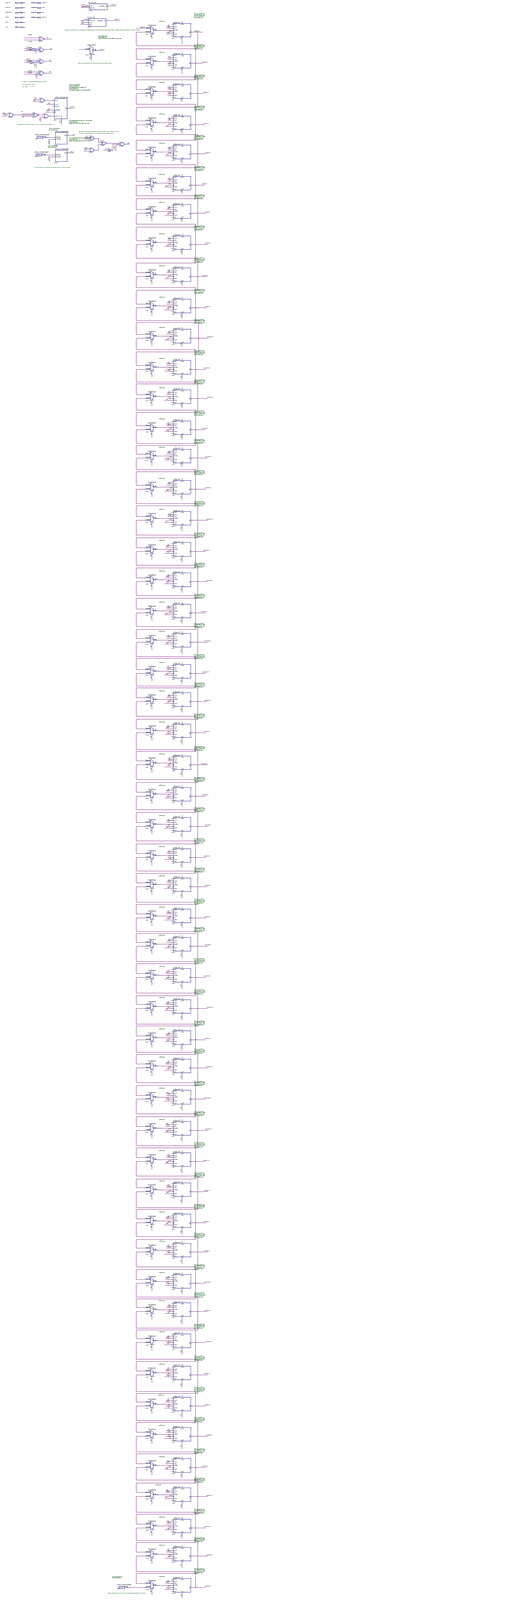
[diagram p0: schematic sheet, whole]
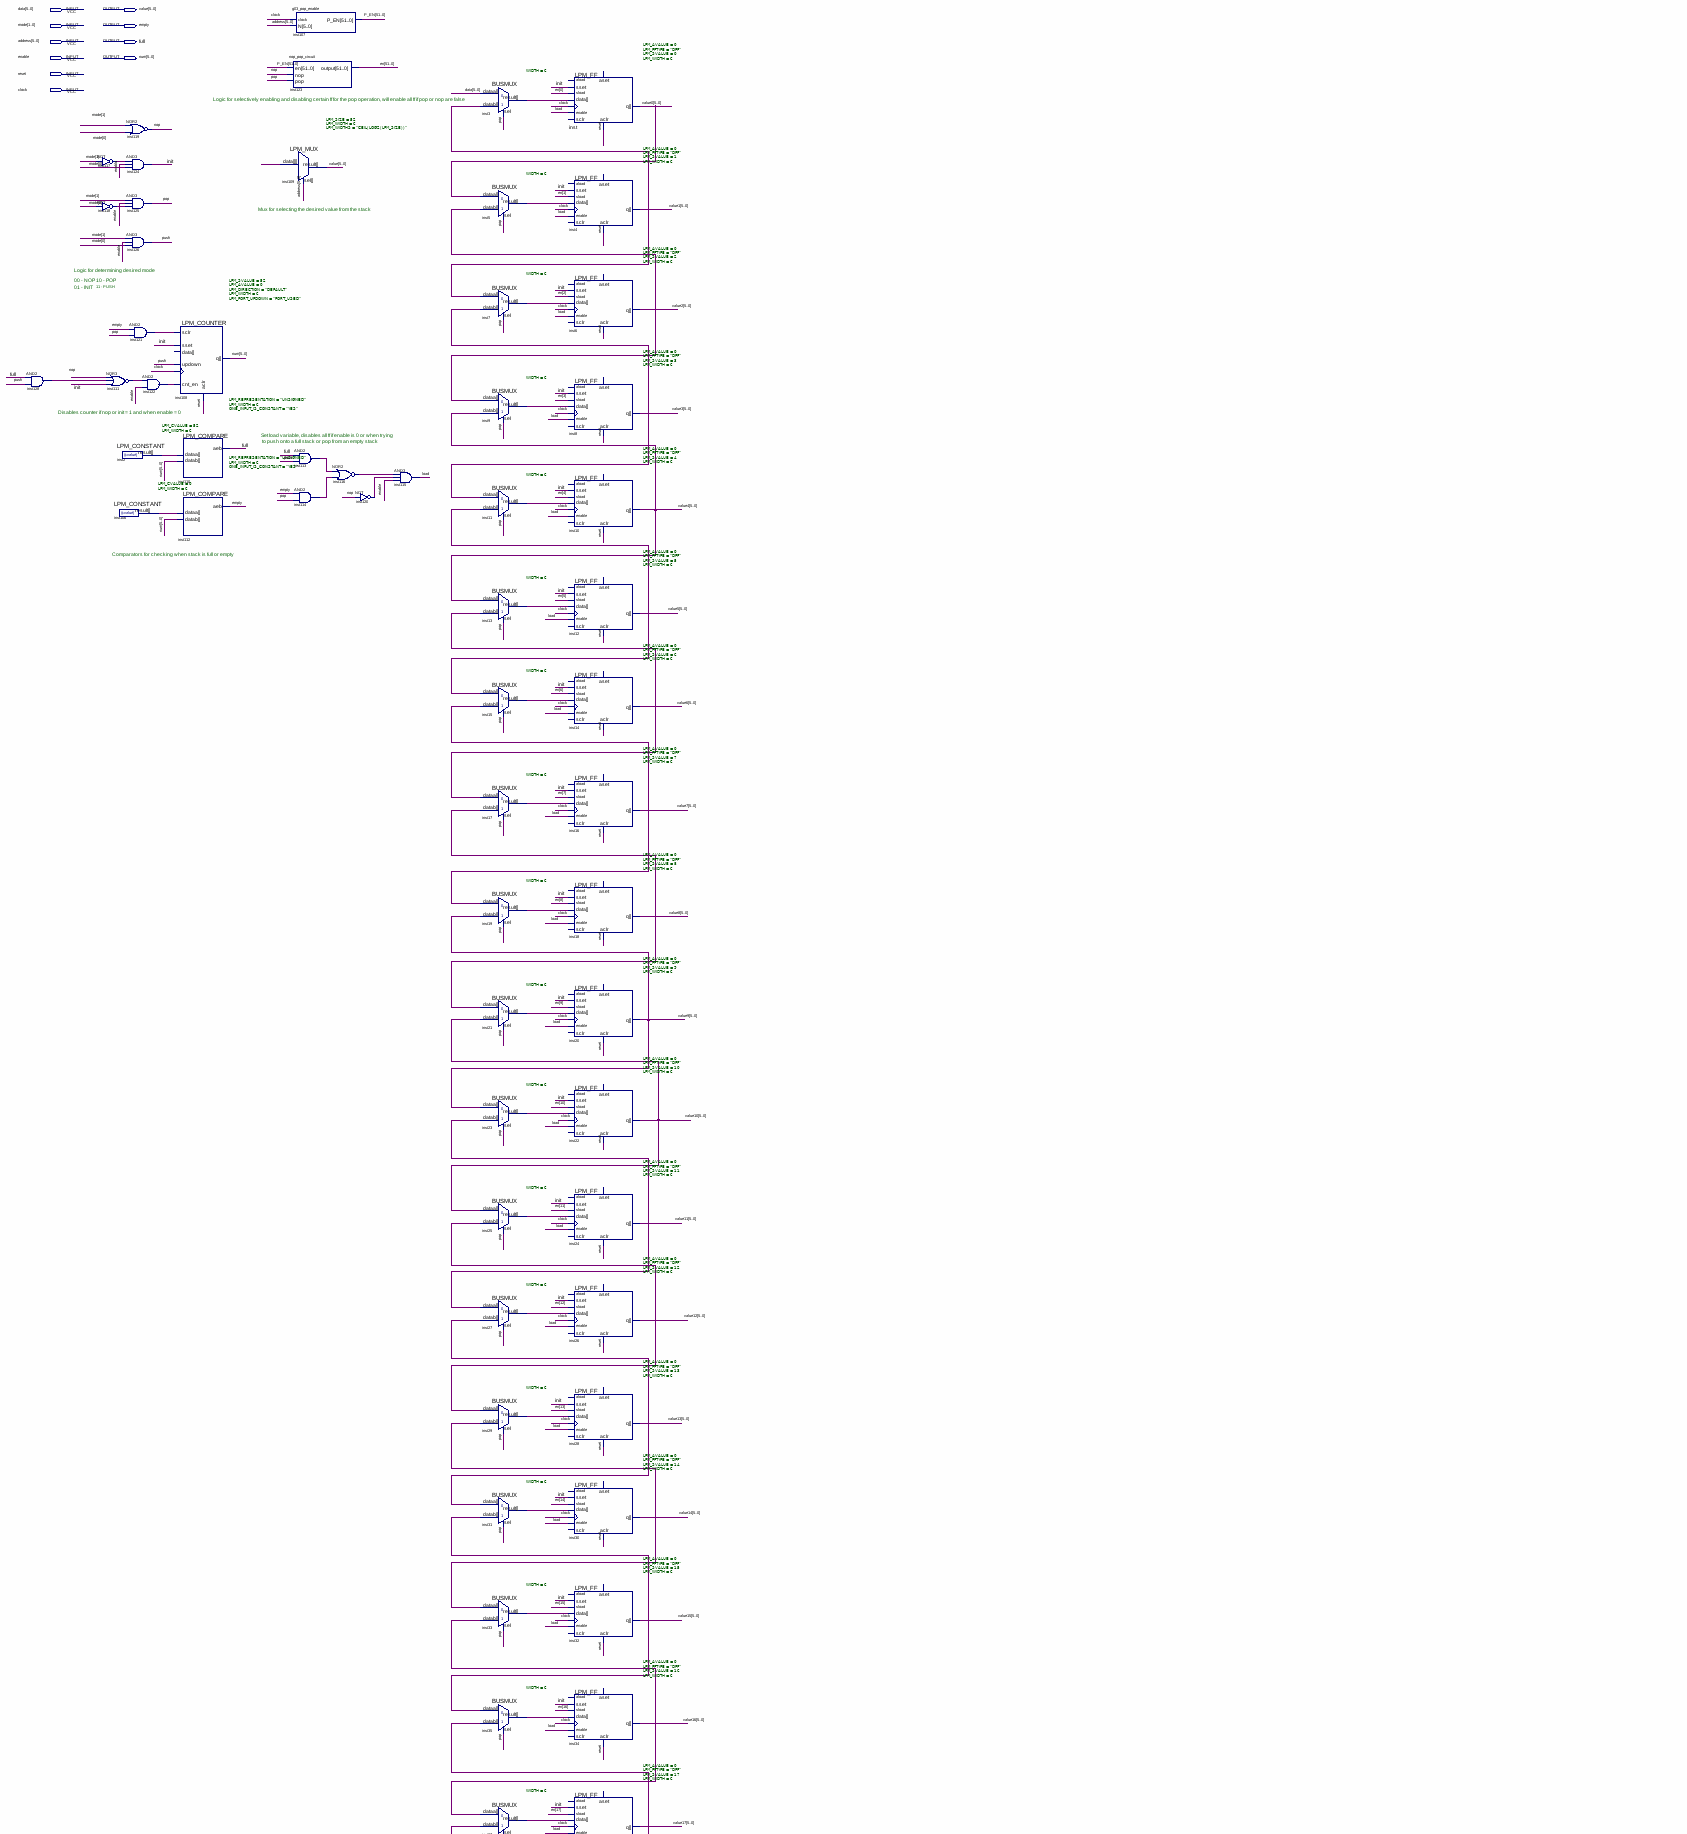
[diagram p1: schematic sheet, upper part]
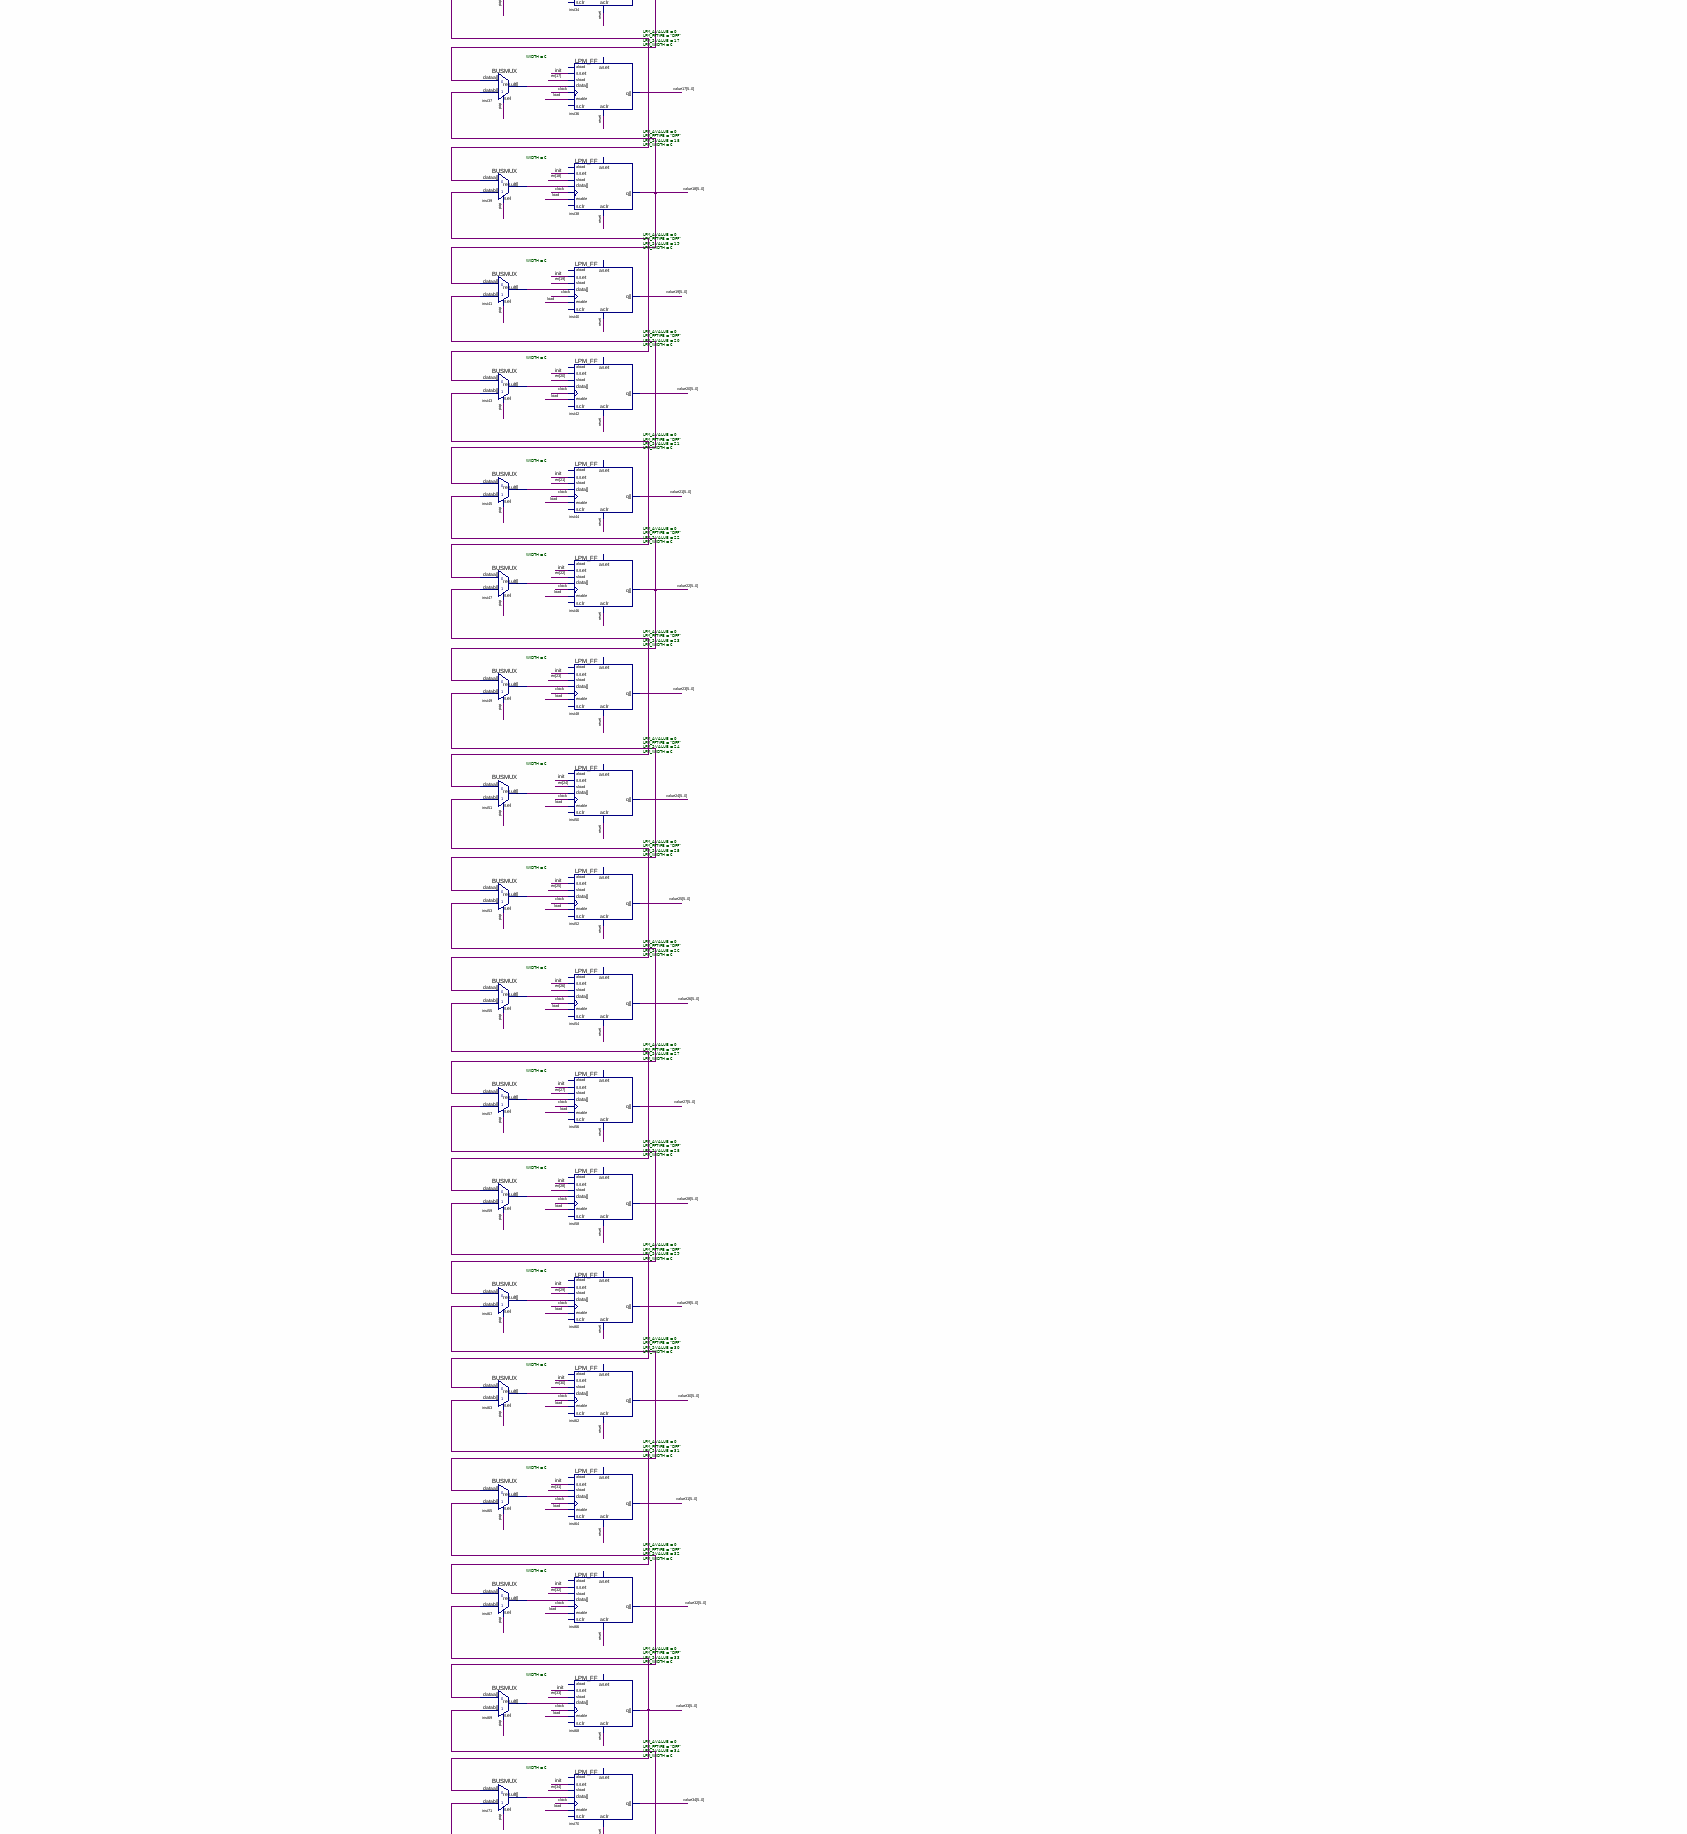
[diagram p2: schematic sheet, middle part]
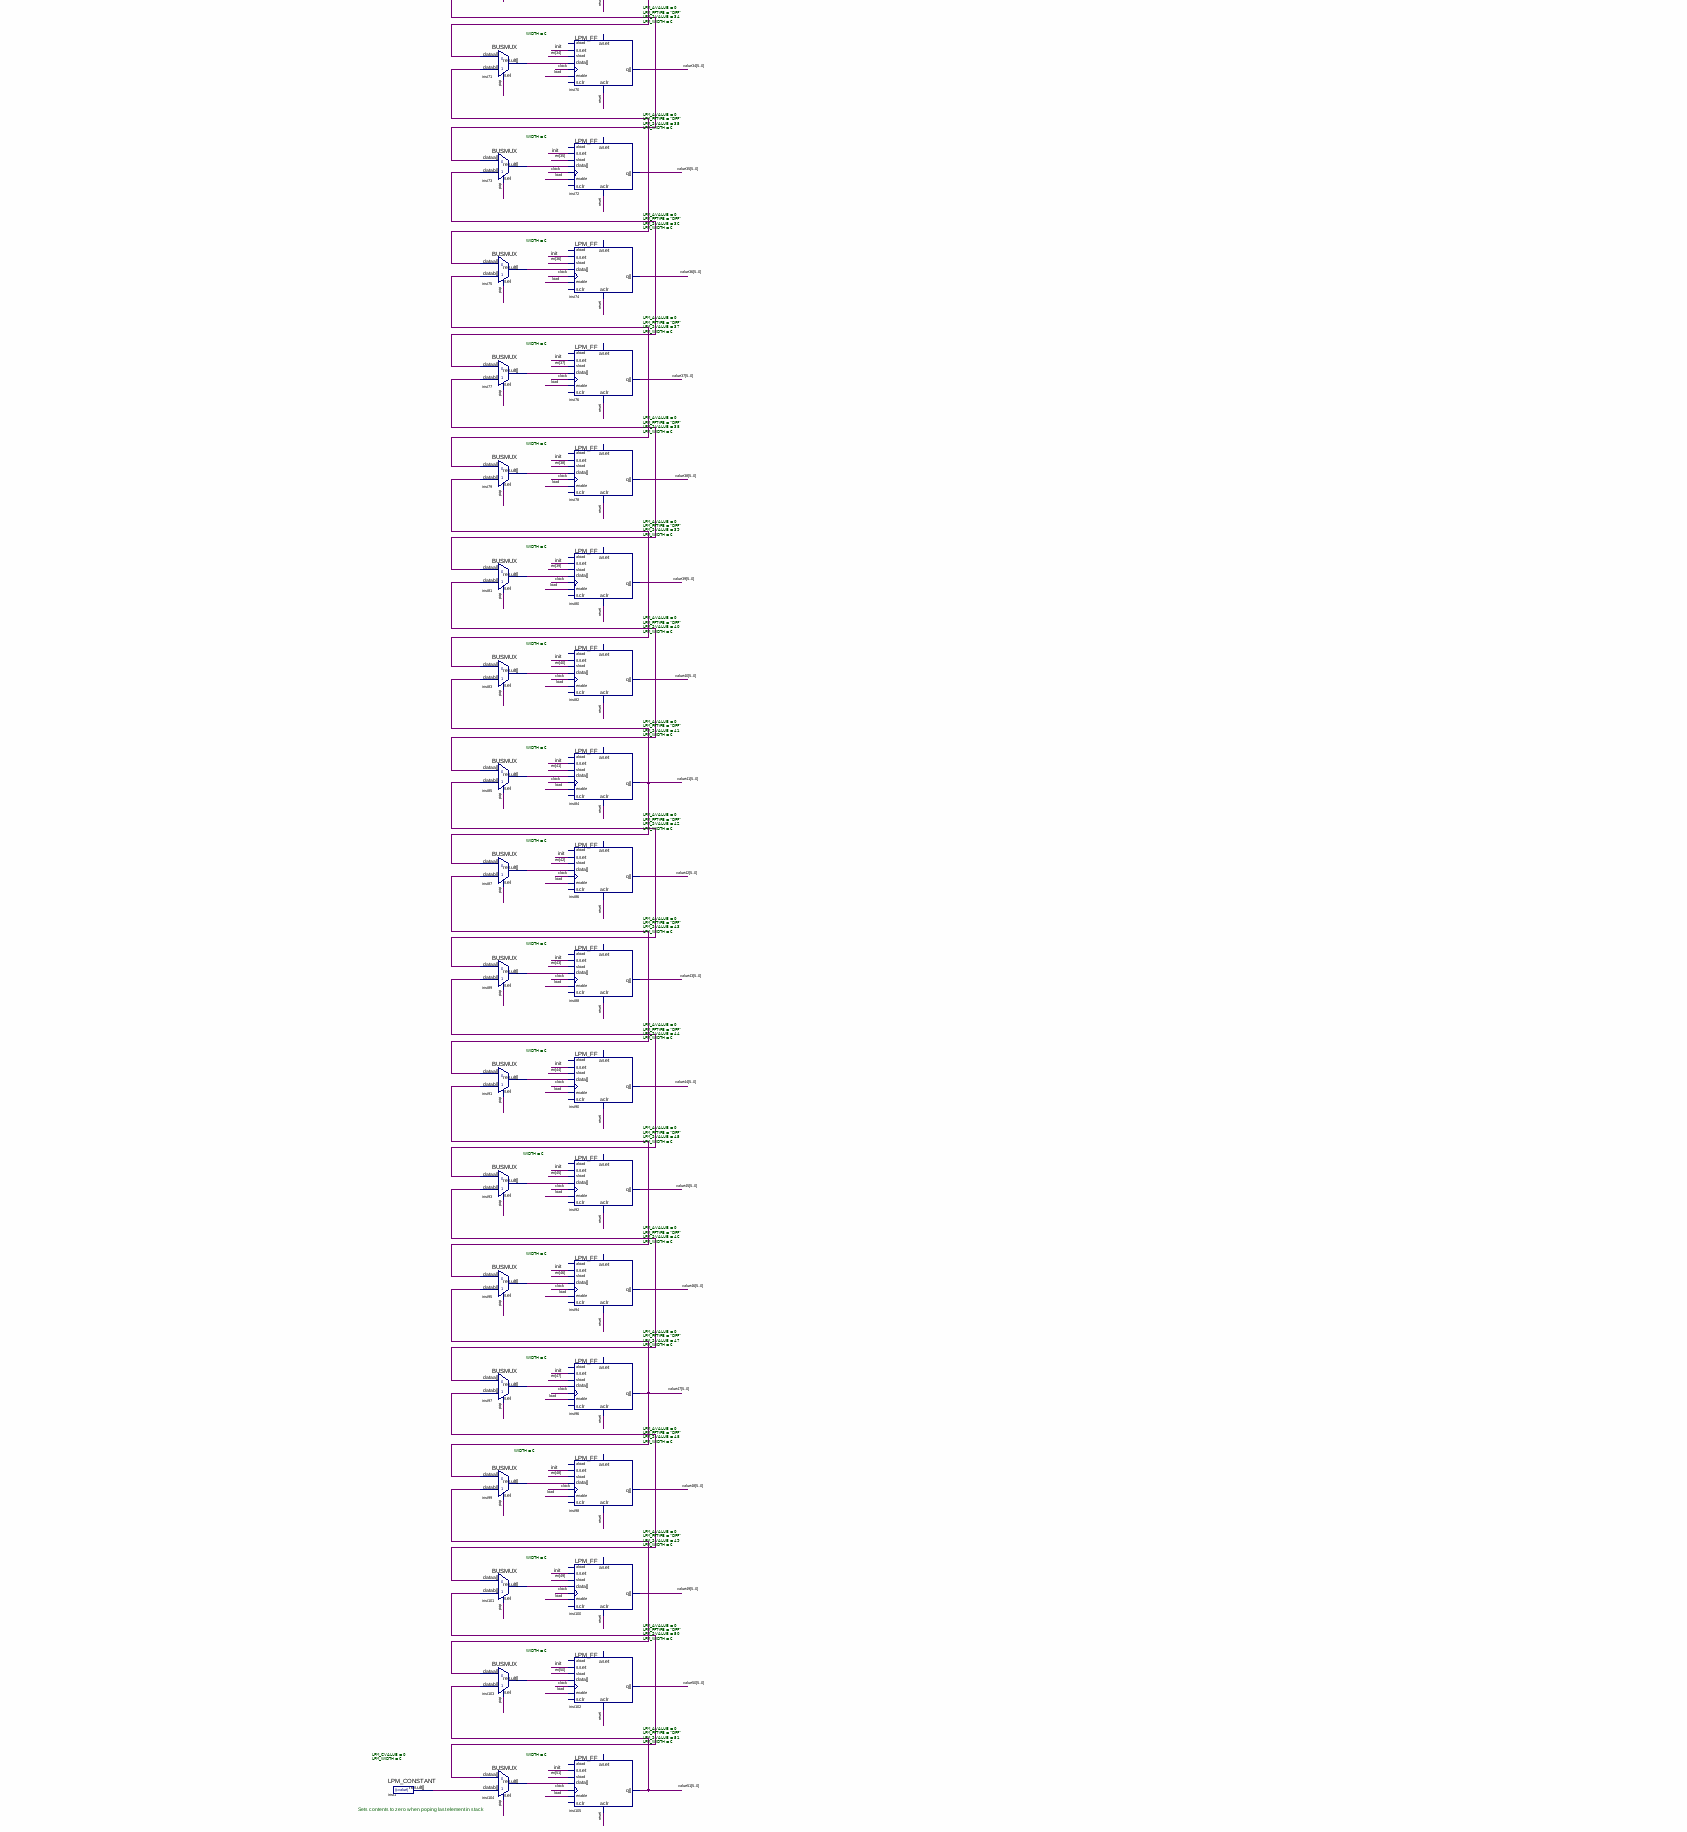
[diagram p3: schematic sheet, lower part]
// Quartus schematic g03_stack52.bdf as structural Verilog: 128 symbols, 10 pins
module g03_stack52 (
  input  [5:0] data,
  input  [1:0] mode,
  input  [5:0] address,
  input  enable,
  input  reset,
  input  clock,
  output [5:0] value,
  output empty,
  output full,
  output [5:0] num
);

  wire init, inst111_out, inst113_out, inst114_out, inst116_out, inst117_out, inst118_out, inst120_out,
       inst121_out, inst122_out, inst128_out, load, nop, pop, push;
  wire [5:0] inst1_result, inst2_result, inst3_result, inst5_result, inst7_result, inst9_result,
       inst11_result, inst13_result, inst15_result, inst17_result, inst19_result, inst21_result,
       inst23_result, inst25_result, inst27_result, inst29_result, inst31_result, inst33_result,
       inst35_result, inst37_result, inst39_result, inst41_result, inst43_result, inst45_result,
       inst47_result, inst49_result, inst51_result, inst53_result, inst55_result, inst57_result,
       inst59_result, inst61_result, inst63_result, inst65_result, inst67_result, inst69_result,
       inst71_result, inst73_result, inst75_result, inst77_result, inst79_result, inst81_result,
       inst83_result, inst85_result, inst87_result, inst89_result, inst91_result, inst93_result,
       inst95_result, inst97_result, inst99_result, inst101_result, inst103_result, inst104_result,
       inst106_result, value0, value1, value2, value3, value4, value5, value6, value7, value8, value9,
       value10, value11, value12, value13, value14, value15, value16, value17, value18, value19, value20,
       value21, value22, value23, value24, value25, value26, value27, value28, value29, value30, value31,
       value32, value33, value34, value35, value36, value37, value38, value39, value40, value41, value42,
       value43, value44, value45, value46, value47, value48, value49, value50, value51;
  wire [51:0] en, P_EN;

  and inst128 (inst128_out, full, push);
  not inst117 (inst117_out, mode[1]);
  not inst118 (inst118_out, mode[0]);
  nor inst111 (inst111_out, nop, inst128_out, init);
  LPM_CONSTANT #(.LPM_CVALUE(52), .LPM_WIDTH(6)) inst2 (.result(inst2_result));
  LPM_CONSTANT #(.LPM_CVALUE(0), .LPM_WIDTH(6)) inst106 (.result(inst106_result));
  nor inst119 (nop, mode[1], mode[0]);
  and inst124 (init, inst117_out, enable, mode[0]);
  and inst125 (pop, mode[1], enable, inst118_out);
  and inst126 (push, mode[1], enable, mode[0]);
  and inst121 (inst121_out, empty, pop);
  and inst122 (inst122_out, inst111_out, enable);
  LPM_COUNTER #(.LPM_SVALUE(52), .LPM_AVALUE(0), .LPM_DIRECTION("DEFAULT"), .LPM_WIDTH(6), .LPM_PORT_UPDOWN("PORT_USED")) inst108 (
    .aclr(reset), .clock(clock), .cnt_en(inst122_out), .sclr(inst121_out), .sset(init), .updown(push), .q(num));  // open: data
  LPM_COMPARE #(.LPM_REPRESENTATION("UNSIGNED"), .LPM_WIDTH(6), .ONE_INPUT_IS_CONSTANT("YES")) inst110 (
    .dataa(inst2_result), .datab(num), .aeb(full));
  LPM_COMPARE #(.LPM_REPRESENTATION("UNSIGNED"), .LPM_WIDTH(6), .ONE_INPUT_IS_CONSTANT("YES")) inst112 (
    .dataa(inst106_result), .datab(num), .aeb(empty));
  g03_pop_enable inst107 (.clock(clock), .N(address), .P_EN(P_EN));
  nop_pop_circuit inst123 (.en(P_EN), .nop(nop), .pop(pop), .\output (en));
  LPM_MUX #(.LPM_SIZE(52), .LPM_WIDTH(6), .LPM_WIDTHS("CEIL(LOG2(LPM_SIZE))")) inst109 (
    .data({value51, value50, value49, value48, value47, value46, value45, value44, value43, value42, value41, value40, value39, value38, value37, value36, value35, value34, value33, value32, value31, value30, value29, value28, value27, value26, value25, value24, value23, value22, value21, value20, value19, value18, value17, value16, value15, value14, value13, value12, value11, value10, value9, value8, value7, value6, value5, value4, value3, value2, value1, value0}),
    .sel(address), .result(value));
  and inst113 (inst113_out, full, push);
  and inst114 (inst114_out, empty, pop);
  nor inst116 (inst116_out, inst113_out, inst114_out);
  not inst120 (inst120_out, nop);
  and inst115 (load, inst116_out, inst120_out, enable);
  LPM_CONSTANT #(.LPM_CVALUE(0), .LPM_WIDTH(6)) inst1 (.result(inst1_result));
  BUSMUX #(.WIDTH(6)) inst3 (.datab(value1), .sel(pop), .dataa(data), .result(inst3_result));
  BUSMUX #(.WIDTH(6)) inst5 (.datab(value2), .sel(pop), .dataa(value0), .result(inst5_result));
  BUSMUX #(.WIDTH(6)) inst7 (.datab(value3), .sel(pop), .dataa(value1), .result(inst7_result));
  BUSMUX #(.WIDTH(6)) inst9 (.datab(value4), .sel(pop), .dataa(value2), .result(inst9_result));
  BUSMUX #(.WIDTH(6)) inst11 (.datab(value5), .sel(pop), .dataa(value3), .result(inst11_result));
  BUSMUX #(.WIDTH(6)) inst13 (.datab(value6), .sel(pop), .dataa(value4), .result(inst13_result));
  BUSMUX #(.WIDTH(6)) inst15 (.datab(value7), .sel(pop), .dataa(value5), .result(inst15_result));
  BUSMUX #(.WIDTH(6)) inst17 (.datab(value8), .sel(pop), .dataa(value6), .result(inst17_result));
  BUSMUX #(.WIDTH(6)) inst19 (.datab(value9), .sel(pop), .dataa(value7), .result(inst19_result));
  BUSMUX #(.WIDTH(6)) inst21 (.datab(value10), .sel(pop), .dataa(value8), .result(inst21_result));
  BUSMUX #(.WIDTH(6)) inst23 (.datab(value11), .sel(pop), .dataa(value9), .result(inst23_result));
  BUSMUX #(.WIDTH(6)) inst25 (.datab(value12), .sel(pop), .dataa(value10), .result(inst25_result));
  BUSMUX #(.WIDTH(6)) inst27 (.datab(value13), .sel(pop), .dataa(value11), .result(inst27_result));
  BUSMUX #(.WIDTH(6)) inst29 (.datab(value14), .sel(pop), .dataa(value12), .result(inst29_result));
  BUSMUX #(.WIDTH(6)) inst31 (.datab(value15), .sel(pop), .dataa(value13), .result(inst31_result));
  BUSMUX #(.WIDTH(6)) inst33 (.datab(value16), .sel(pop), .dataa(value14), .result(inst33_result));
  BUSMUX #(.WIDTH(6)) inst35 (.datab(value17), .sel(pop), .dataa(value15), .result(inst35_result));
  BUSMUX #(.WIDTH(6)) inst37 (.datab(value18), .sel(pop), .dataa(value16), .result(inst37_result));
  BUSMUX #(.WIDTH(6)) inst39 (.datab(value19), .sel(pop), .dataa(value17), .result(inst39_result));
  BUSMUX #(.WIDTH(6)) inst41 (.datab(value20), .sel(pop), .dataa(value18), .result(inst41_result));
  BUSMUX #(.WIDTH(6)) inst43 (.datab(value21), .sel(pop), .dataa(value19), .result(inst43_result));
  BUSMUX #(.WIDTH(6)) inst45 (.datab(value22), .sel(pop), .dataa(value20), .result(inst45_result));
  BUSMUX #(.WIDTH(6)) inst47 (.datab(value23), .sel(pop), .dataa(value21), .result(inst47_result));
  BUSMUX #(.WIDTH(6)) inst49 (.datab(value24), .sel(pop), .dataa(value22), .result(inst49_result));
  BUSMUX #(.WIDTH(6)) inst51 (.datab(value25), .sel(pop), .dataa(value23), .result(inst51_result));
  BUSMUX #(.WIDTH(6)) inst53 (.datab(value26), .sel(pop), .dataa(value24), .result(inst53_result));
  BUSMUX #(.WIDTH(6)) inst55 (.datab(value27), .sel(pop), .dataa(value25), .result(inst55_result));
  BUSMUX #(.WIDTH(6)) inst57 (.datab(value28), .sel(pop), .dataa(value26), .result(inst57_result));
  BUSMUX #(.WIDTH(6)) inst59 (.datab(value29), .sel(pop), .dataa(value27), .result(inst59_result));
  BUSMUX #(.WIDTH(6)) inst61 (.datab(value30), .sel(pop), .dataa(value28), .result(inst61_result));
  BUSMUX #(.WIDTH(6)) inst63 (.datab(value31), .sel(pop), .dataa(value29), .result(inst63_result));
  BUSMUX #(.WIDTH(6)) inst65 (.datab(value32), .sel(pop), .dataa(value30), .result(inst65_result));
  BUSMUX #(.WIDTH(6)) inst67 (.datab(value33), .sel(pop), .dataa(value31), .result(inst67_result));
  BUSMUX #(.WIDTH(6)) inst69 (.datab(value34), .sel(pop), .dataa(value32), .result(inst69_result));
  BUSMUX #(.WIDTH(6)) inst71 (.datab(value35), .sel(pop), .dataa(value33), .result(inst71_result));
  BUSMUX #(.WIDTH(6)) inst73 (.datab(value36), .sel(pop), .dataa(value34), .result(inst73_result));
  BUSMUX #(.WIDTH(6)) inst75 (.datab(value37), .sel(pop), .dataa(value35), .result(inst75_result));
  BUSMUX #(.WIDTH(6)) inst77 (.datab(value38), .sel(pop), .dataa(value36), .result(inst77_result));
  BUSMUX #(.WIDTH(6)) inst79 (.datab(value39), .sel(pop), .dataa(value37), .result(inst79_result));
  BUSMUX #(.WIDTH(6)) inst81 (.datab(value40), .sel(pop), .dataa(value38), .result(inst81_result));
  BUSMUX #(.WIDTH(6)) inst83 (.datab(value41), .sel(pop), .dataa(value39), .result(inst83_result));
  BUSMUX #(.WIDTH(6)) inst85 (.datab(value42), .sel(pop), .dataa(value40), .result(inst85_result));
  BUSMUX #(.WIDTH(6)) inst87 (.datab(value43), .sel(pop), .dataa(value41), .result(inst87_result));
  BUSMUX #(.WIDTH(6)) inst89 (.datab(value44), .sel(pop), .dataa(value42), .result(inst89_result));
  BUSMUX #(.WIDTH(6)) inst91 (.datab(value45), .sel(pop), .dataa(value43), .result(inst91_result));
  BUSMUX #(.WIDTH(6)) inst93 (.datab(value46), .sel(pop), .dataa(value44), .result(inst93_result));
  BUSMUX #(.WIDTH(6)) inst95 (.datab(value47), .sel(pop), .dataa(value45), .result(inst95_result));
  BUSMUX #(.WIDTH(6)) inst97 (.datab(value48), .sel(pop), .dataa(value46), .result(inst97_result));
  BUSMUX #(.WIDTH(6)) inst99 (.datab(value49), .sel(pop), .dataa(value47), .result(inst99_result));
  BUSMUX #(.WIDTH(6)) inst101 (.datab(value50), .sel(pop), .dataa(value48), .result(inst101_result));
  BUSMUX #(.WIDTH(6)) inst103 (.datab(value51), .sel(pop), .dataa(value49), .result(inst103_result));
  BUSMUX #(.WIDTH(6)) inst104 (.datab(inst1_result), .sel(pop), .dataa(value50), .result(inst104_result));
  LPM_FF #(.LPM_AVALUE(0), .LPM_FFTYPE("DFF"), .LPM_SVALUE(0), .LPM_WIDTH(6)) inst (
    .aclr(reset), .clock(clock), .data(inst3_result), .enable(load), .sload(en[0]), .sset(init), .q(value0));  // open: aload, aset, sclr
  LPM_FF #(.LPM_AVALUE(0), .LPM_FFTYPE("DFF"), .LPM_SVALUE(1), .LPM_WIDTH(6)) inst4 (
    .aclr(reset), .clock(clock), .data(inst5_result), .enable(load), .sload(en[1]), .sset(init), .q(value1));  // open: aload, aset, sclr
  LPM_FF #(.LPM_AVALUE(0), .LPM_FFTYPE("DFF"), .LPM_SVALUE(2), .LPM_WIDTH(6)) inst6 (
    .enable(load), .clock(clock), .sset(init), .sload(en[2]), .aclr(reset), .data(inst7_result), .q(value2));  // open: aload, aset, sclr
  LPM_FF #(.LPM_AVALUE(0), .LPM_FFTYPE("DFF"), .LPM_SVALUE(3), .LPM_WIDTH(6)) inst8 (
    .enable(load), .clock(clock), .sset(init), .sload(en[3]), .aclr(reset), .data(inst9_result), .q(value3));  // open: aload, aset, sclr
  LPM_FF #(.LPM_AVALUE(0), .LPM_FFTYPE("DFF"), .LPM_SVALUE(4), .LPM_WIDTH(6)) inst10 (
    .enable(load), .clock(clock), .sset(init), .sload(en[4]), .aclr(reset), .data(inst11_result), .q(value4));  // open: aload, aset, sclr
  LPM_FF #(.LPM_AVALUE(0), .LPM_FFTYPE("DFF"), .LPM_SVALUE(5), .LPM_WIDTH(6)) inst12 (
    .enable(load), .clock(clock), .sset(init), .sload(en[5]), .aclr(reset), .data(inst13_result), .q(value5));  // open: aload, aset, sclr
  LPM_FF #(.LPM_AVALUE(0), .LPM_FFTYPE("DFF"), .LPM_SVALUE(6), .LPM_WIDTH(6)) inst14 (
    .enable(load), .clock(clock), .sset(init), .sload(en[6]), .aclr(reset), .data(inst15_result), .q(value6));  // open: aload, aset, sclr
  LPM_FF #(.LPM_AVALUE(0), .LPM_FFTYPE("DFF"), .LPM_SVALUE(7), .LPM_WIDTH(6)) inst16 (
    .enable(load), .clock(clock), .sset(init), .sload(en[7]), .aclr(reset), .data(inst17_result), .q(value7));  // open: aload, aset, sclr
  LPM_FF #(.LPM_AVALUE(0), .LPM_FFTYPE("DFF"), .LPM_SVALUE(8), .LPM_WIDTH(6)) inst18 (
    .enable(load), .clock(clock), .sset(init), .sload(en[8]), .aclr(reset), .data(inst19_result), .q(value8));  // open: aload, aset, sclr
  LPM_FF #(.LPM_AVALUE(0), .LPM_FFTYPE("DFF"), .LPM_SVALUE(9), .LPM_WIDTH(6)) inst20 (
    .enable(load), .clock(clock), .sset(init), .sload(en[9]), .aclr(reset), .data(inst21_result), .q(value9));  // open: aload, aset, sclr
  LPM_FF #(.LPM_AVALUE(0), .LPM_FFTYPE("DFF"), .LPM_SVALUE(10), .LPM_WIDTH(6)) inst22 (
    .enable(load), .clock(clock), .sset(init), .sload(en[10]), .aclr(reset), .data(inst23_result), .q(value10));  // open: aload, aset, sclr
  LPM_FF #(.LPM_AVALUE(0), .LPM_FFTYPE("DFF"), .LPM_SVALUE(11), .LPM_WIDTH(6)) inst24 (
    .enable(load), .clock(clock), .sset(init), .sload(en[11]), .aclr(reset), .data(inst25_result), .q(value11));  // open: aload, aset, sclr
  LPM_FF #(.LPM_AVALUE(0), .LPM_FFTYPE("DFF"), .LPM_SVALUE(12), .LPM_WIDTH(6)) inst26 (
    .enable(load), .clock(clock), .sset(init), .sload(en[12]), .aclr(reset), .data(inst27_result), .q(value12));  // open: aload, aset, sclr
  LPM_FF #(.LPM_AVALUE(0), .LPM_FFTYPE("DFF"), .LPM_SVALUE(13), .LPM_WIDTH(6)) inst28 (
    .enable(load), .clock(clock), .sset(init), .sload(en[13]), .aclr(reset), .data(inst29_result), .q(value13));  // open: aload, aset, sclr
  LPM_FF #(.LPM_AVALUE(0), .LPM_FFTYPE("DFF"), .LPM_SVALUE(14), .LPM_WIDTH(6)) inst30 (
    .enable(load), .clock(clock), .sset(init), .sload(en[14]), .aclr(reset), .data(inst31_result), .q(value14));  // open: aload, aset, sclr
  LPM_FF #(.LPM_AVALUE(0), .LPM_FFTYPE("DFF"), .LPM_SVALUE(15), .LPM_WIDTH(6)) inst32 (
    .enable(load), .clock(clock), .sset(init), .sload(en[15]), .aclr(reset), .data(inst33_result), .q(value15));  // open: aload, aset, sclr
  LPM_FF #(.LPM_AVALUE(0), .LPM_FFTYPE("DFF"), .LPM_SVALUE(16), .LPM_WIDTH(6)) inst34 (
    .enable(load), .clock(clock), .sset(init), .sload(en[16]), .aclr(reset), .data(inst35_result), .q(value16));  // open: aload, aset, sclr
  LPM_FF #(.LPM_AVALUE(0), .LPM_FFTYPE("DFF"), .LPM_SVALUE(17), .LPM_WIDTH(6)) inst36 (
    .enable(load), .clock(clock), .sset(init), .sload(en[17]), .aclr(reset), .data(inst37_result), .q(value17));  // open: aload, aset, sclr
  LPM_FF #(.LPM_AVALUE(0), .LPM_FFTYPE("DFF"), .LPM_SVALUE(18), .LPM_WIDTH(6)) inst38 (
    .enable(load), .clock(clock), .sset(init), .sload(en[18]), .aclr(reset), .data(inst39_result), .q(value18));  // open: aload, aset, sclr
  LPM_FF #(.LPM_AVALUE(0), .LPM_FFTYPE("DFF"), .LPM_SVALUE(19), .LPM_WIDTH(6)) inst40 (
    .enable(load), .clock(clock), .sset(init), .sload(en[19]), .aclr(reset), .data(inst41_result), .q(value19));  // open: aload, aset, sclr
  LPM_FF #(.LPM_AVALUE(0), .LPM_FFTYPE("DFF"), .LPM_SVALUE(20), .LPM_WIDTH(6)) inst42 (
    .enable(load), .clock(clock), .sset(init), .sload(en[20]), .aclr(reset), .data(inst43_result), .q(value20));  // open: aload, aset, sclr
  LPM_FF #(.LPM_AVALUE(0), .LPM_FFTYPE("DFF"), .LPM_SVALUE(21), .LPM_WIDTH(6)) inst44 (
    .enable(load), .clock(clock), .sset(init), .sload(en[21]), .aclr(reset), .data(inst45_result), .q(value21));  // open: aload, aset, sclr
  LPM_FF #(.LPM_AVALUE(0), .LPM_FFTYPE("DFF"), .LPM_SVALUE(22), .LPM_WIDTH(6)) inst46 (
    .enable(load), .clock(clock), .sset(init), .sload(en[22]), .aclr(reset), .data(inst47_result), .q(value22));  // open: aload, aset, sclr
  LPM_FF #(.LPM_AVALUE(0), .LPM_FFTYPE("DFF"), .LPM_SVALUE(23), .LPM_WIDTH(6)) inst48 (
    .enable(load), .clock(clock), .sset(init), .sload(en[23]), .aclr(reset), .data(inst49_result), .q(value23));  // open: aload, aset, sclr
  LPM_FF #(.LPM_AVALUE(0), .LPM_FFTYPE("DFF"), .LPM_SVALUE(24), .LPM_WIDTH(6)) inst50 (
    .enable(load), .clock(clock), .sset(init), .sload(en[24]), .aclr(reset), .data(inst51_result), .q(value24));  // open: aload, aset, sclr
  LPM_FF #(.LPM_AVALUE(0), .LPM_FFTYPE("DFF"), .LPM_SVALUE(25), .LPM_WIDTH(6)) inst52 (
    .enable(load), .clock(clock), .sset(init), .sload(en[25]), .aclr(reset), .data(inst53_result), .q(value25));  // open: aload, aset, sclr
  LPM_FF #(.LPM_AVALUE(0), .LPM_FFTYPE("DFF"), .LPM_SVALUE(26), .LPM_WIDTH(6)) inst54 (
    .enable(load), .clock(clock), .sset(init), .sload(en[26]), .aclr(reset), .data(inst55_result), .q(value26));  // open: aload, aset, sclr
  LPM_FF #(.LPM_AVALUE(0), .LPM_FFTYPE("DFF"), .LPM_SVALUE(27), .LPM_WIDTH(6)) inst56 (
    .enable(load), .clock(clock), .sset(init), .sload(en[27]), .aclr(reset), .data(inst57_result), .q(value27));  // open: aload, aset, sclr
  LPM_FF #(.LPM_AVALUE(0), .LPM_FFTYPE("DFF"), .LPM_SVALUE(28), .LPM_WIDTH(6)) inst58 (
    .enable(load), .clock(clock), .sset(init), .sload(en[28]), .aclr(reset), .data(inst59_result), .q(value28));  // open: aload, aset, sclr
  LPM_FF #(.LPM_AVALUE(0), .LPM_FFTYPE("DFF"), .LPM_SVALUE(29), .LPM_WIDTH(6)) inst60 (
    .enable(load), .clock(clock), .sset(init), .sload(en[29]), .aclr(reset), .data(inst61_result), .q(value29));  // open: aload, aset, sclr
  LPM_FF #(.LPM_AVALUE(0), .LPM_FFTYPE("DFF"), .LPM_SVALUE(30), .LPM_WIDTH(6)) inst62 (
    .enable(load), .clock(clock), .sset(init), .sload(en[30]), .aclr(reset), .data(inst63_result), .q(value30));  // open: aload, aset, sclr
  LPM_FF #(.LPM_AVALUE(0), .LPM_FFTYPE("DFF"), .LPM_SVALUE(31), .LPM_WIDTH(6)) inst64 (
    .enable(load), .clock(clock), .sset(init), .sload(en[31]), .aclr(reset), .data(inst65_result), .q(value31));  // open: aload, aset, sclr
  LPM_FF #(.LPM_AVALUE(0), .LPM_FFTYPE("DFF"), .LPM_SVALUE(32), .LPM_WIDTH(6)) inst66 (
    .enable(load), .clock(clock), .sset(init), .sload(en[32]), .aclr(reset), .data(inst67_result), .q(value32));  // open: aload, aset, sclr
  LPM_FF #(.LPM_AVALUE(0), .LPM_FFTYPE("DFF"), .LPM_SVALUE(33), .LPM_WIDTH(6)) inst68 (
    .enable(load), .clock(clock), .sset(init), .sload(en[33]), .aclr(reset), .data(inst69_result), .q(value33));  // open: aload, aset, sclr
  LPM_FF #(.LPM_AVALUE(0), .LPM_FFTYPE("DFF"), .LPM_SVALUE(34), .LPM_WIDTH(6)) inst70 (
    .enable(load), .clock(clock), .sset(init), .sload(en[34]), .aclr(reset), .data(inst71_result), .q(value34));  // open: aload, aset, sclr
  LPM_FF #(.LPM_AVALUE(0), .LPM_FFTYPE("DFF"), .LPM_SVALUE(35), .LPM_WIDTH(6)) inst72 (
    .enable(load), .clock(clock), .sset(init), .sload(en[35]), .aclr(reset), .data(inst73_result), .q(value35));  // open: aload, aset, sclr
  LPM_FF #(.LPM_AVALUE(0), .LPM_FFTYPE("DFF"), .LPM_SVALUE(36), .LPM_WIDTH(6)) inst74 (
    .enable(load), .clock(clock), .sset(init), .sload(en[36]), .aclr(reset), .data(inst75_result), .q(value36));  // open: aload, aset, sclr
  LPM_FF #(.LPM_AVALUE(0), .LPM_FFTYPE("DFF"), .LPM_SVALUE(37), .LPM_WIDTH(6)) inst76 (
    .enable(load), .clock(clock), .sset(init), .sload(en[37]), .aclr(reset), .data(inst77_result), .q(value37));  // open: aload, aset, sclr
  LPM_FF #(.LPM_AVALUE(0), .LPM_FFTYPE("DFF"), .LPM_SVALUE(38), .LPM_WIDTH(6)) inst78 (
    .enable(load), .clock(clock), .sset(init), .sload(en[38]), .aclr(reset), .data(inst79_result), .q(value38));  // open: aload, aset, sclr
  LPM_FF #(.LPM_AVALUE(0), .LPM_FFTYPE("DFF"), .LPM_SVALUE(39), .LPM_WIDTH(6)) inst80 (
    .enable(load), .clock(clock), .sset(init), .sload(en[39]), .aclr(reset), .data(inst81_result), .q(value39));  // open: aload, aset, sclr
  LPM_FF #(.LPM_AVALUE(0), .LPM_FFTYPE("DFF"), .LPM_SVALUE(40), .LPM_WIDTH(6)) inst82 (
    .enable(load), .clock(clock), .sset(init), .sload(en[40]), .aclr(reset), .data(inst83_result), .q(value40));  // open: aload, aset, sclr
  LPM_FF #(.LPM_AVALUE(0), .LPM_FFTYPE("DFF"), .LPM_SVALUE(41), .LPM_WIDTH(6)) inst84 (
    .enable(load), .clock(clock), .sset(init), .sload(en[41]), .aclr(reset), .data(inst85_result), .q(value41));  // open: aload, aset, sclr
  LPM_FF #(.LPM_AVALUE(0), .LPM_FFTYPE("DFF"), .LPM_SVALUE(42), .LPM_WIDTH(6)) inst86 (
    .enable(load), .clock(clock), .sset(init), .sload(en[42]), .aclr(reset), .data(inst87_result), .q(value42));  // open: aload, aset, sclr
  LPM_FF #(.LPM_AVALUE(0), .LPM_FFTYPE("DFF"), .LPM_SVALUE(43), .LPM_WIDTH(6)) inst88 (
    .enable(load), .clock(clock), .sset(init), .sload(en[43]), .aclr(reset), .data(inst89_result), .q(value43));  // open: aload, aset, sclr
  LPM_FF #(.LPM_AVALUE(0), .LPM_FFTYPE("DFF"), .LPM_SVALUE(44), .LPM_WIDTH(6)) inst90 (
    .enable(load), .clock(clock), .sset(init), .sload(en[44]), .aclr(reset), .data(inst91_result), .q(value44));  // open: aload, aset, sclr
  LPM_FF #(.LPM_AVALUE(0), .LPM_FFTYPE("DFF"), .LPM_SVALUE(45), .LPM_WIDTH(6)) inst92 (
    .enable(load), .clock(clock), .sset(init), .sload(en[45]), .aclr(reset), .data(inst93_result), .q(value45));  // open: aload, aset, sclr
  LPM_FF #(.LPM_AVALUE(0), .LPM_FFTYPE("DFF"), .LPM_SVALUE(46), .LPM_WIDTH(6)) inst94 (
    .enable(load), .clock(clock), .sset(init), .sload(en[46]), .aclr(reset), .data(inst95_result), .q(value46));  // open: aload, aset, sclr
  LPM_FF #(.LPM_AVALUE(0), .LPM_FFTYPE("DFF"), .LPM_SVALUE(47), .LPM_WIDTH(6)) inst96 (
    .enable(load), .clock(clock), .sset(init), .sload(en[47]), .aclr(reset), .data(inst97_result), .q(value47));  // open: aload, aset, sclr
  LPM_FF #(.LPM_AVALUE(0), .LPM_FFTYPE("DFF"), .LPM_SVALUE(48), .LPM_WIDTH(6)) inst98 (
    .enable(load), .clock(clock), .sset(init), .sload(en[48]), .aclr(reset), .data(inst99_result), .q(value48));  // open: aload, aset, sclr
  LPM_FF #(.LPM_AVALUE(0), .LPM_FFTYPE("DFF"), .LPM_SVALUE(49), .LPM_WIDTH(6)) inst100 (
    .enable(load), .clock(clock), .sset(init), .sload(en[49]), .aclr(reset), .data(inst101_result),
    .q(value49));  // open: aload, aset, sclr
  LPM_FF #(.LPM_AVALUE(0), .LPM_FFTYPE("DFF"), .LPM_SVALUE(50), .LPM_WIDTH(6)) inst102 (
    .enable(load), .clock(clock), .sset(init), .sload(en[50]), .aclr(reset), .data(inst103_result),
    .q(value50));  // open: aload, aset, sclr
  LPM_FF #(.LPM_AVALUE(0), .LPM_FFTYPE("DFF"), .LPM_SVALUE(51), .LPM_WIDTH(6)) inst105 (
    .enable(load), .clock(clock), .sset(init), .sload(en[51]), .aclr(reset), .data(inst104_result),
    .q(value51));  // open: aload, aset, sclr

  // Notes on the sheet:
  //   Logic for selectively enabling and disabling certain ff for the pop operation, will enable all ff if pop or nop are false
  //   Mux for selecting the desired value from the stack
  //   Logic for determining desired mode
  //   00 - NOP
  //   10 - POP
  //   01 - INIT
  //   11 - PUSH
  //   Disables counter if nop or init = 1 and when enable = 0
  //   Set load variable, disables all ff if enable is 0 or when trying
  //    to push onto a full stack or pop from an empty stack
  //   Comparators for checking when stack is full or empty
  //   Sets contents to zero when poping last element in stack
endmodule
